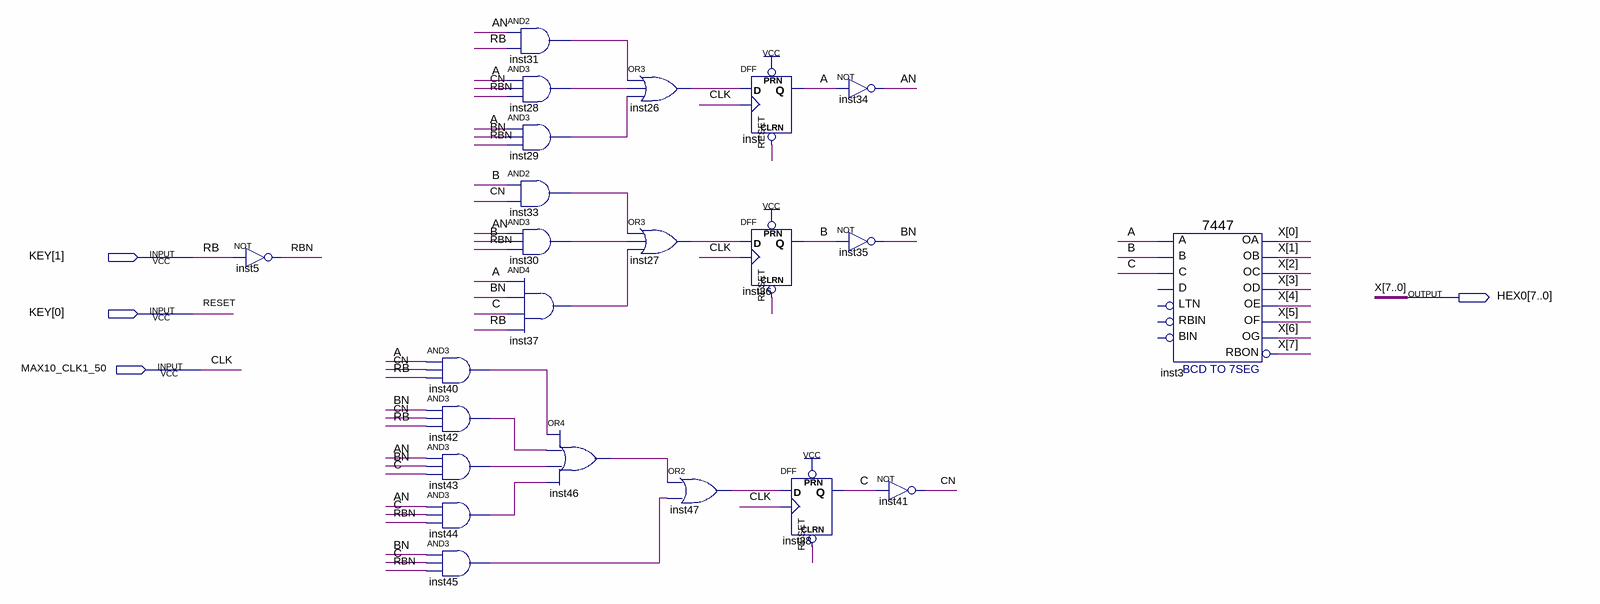
[diagram p0: schematic sheet]
// Quartus schematic lab5a.bdf as structural Verilog: 23 symbols, 4 pins
module lab5a (
  input  [1:0] KEY,
  input  MAX10_CLK1_50,
  output [7:0] HEX0
);

  wire A, AN, B, BN, C, CN, inst26_out, inst27_out, inst28_out, inst29_out, inst30_out, inst31_out,
       inst33_out, inst37_out, inst40_out, inst42_out, inst43_out, inst44_out, inst45_out, inst46_out,
       inst47_out, RBN;

  not inst5 (RBN, KEY[1]);
  and inst40 (inst40_out, A, CN, KEY[1]);
  and inst42 (inst42_out, BN, CN, KEY[1]);
  and inst43 (inst43_out, AN, BN, C);
  and inst44 (inst44_out, AN, C, RBN);
  and inst45 (inst45_out, BN, C, RBN);
  and inst31 (inst31_out, AN, KEY[1]);
  and inst28 (inst28_out, A, CN, RBN);
  and inst29 (inst29_out, A, BN, RBN);
  and inst33 (inst33_out, B, CN);
  and inst30 (inst30_out, AN, B, RBN);
  and inst37 (inst37_out, A, BN, C, KEY[1]);
  or inst46 (inst46_out, inst40_out, inst42_out, inst43_out, inst44_out);
  or inst26 (inst26_out, inst31_out, inst28_out, inst29_out);
  or inst27 (inst27_out, inst33_out, inst30_out, inst37_out);
  or inst47 (inst47_out, inst46_out, inst45_out);
  DFF inst (.CLRN(KEY[0]), .CLK(MAX10_CLK1_50), .D(inst26_out), .PRN(1'b1), .Q(A));
  DFF inst36 (.CLRN(KEY[0]), .CLK(MAX10_CLK1_50), .D(inst27_out), .PRN(1'b1), .Q(B));
  DFF inst38 (.CLRN(KEY[0]), .CLK(MAX10_CLK1_50), .D(inst47_out), .PRN(1'b1), .Q(C));
  not inst34 (AN, A);
  not inst35 (BN, B);
  not inst41 (CN, C);
  \7447  inst3 (
    .B(B), .C(C), .A(A), .OB(HEX0[1]), .OC(HEX0[2]), .OE(HEX0[4]), .OD(HEX0[3]), .OF(HEX0[5]), .OG(HEX0[6]),
    .OA(HEX0[0]), .RBON(HEX0[7]));  // open: LTN, D, RBIN, BIN

  // Other names for the same wires on the sheet: CLK = MAX10_CLK1_50; RB = KEY[1]; RESET = KEY[0]; X[7:0] = HEX0
endmodule
